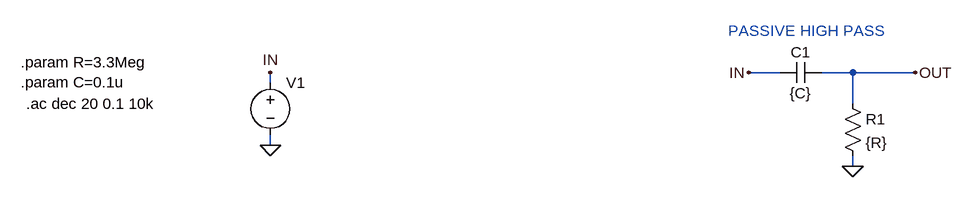
[diagram p0: schematic highpass-passive.asc]
highpass-passive.asc, the LTspice schematic file:
Version 4
SHEET 1 996 680
WIRE 720 160 672 160
WIRE 832 160 784 160
WIRE 928 160 832 160
WIRE -64 176 -64 160
WIRE 832 208 832 160
WIRE -64 272 -64 256
WIRE 832 304 832 288
FLAG 832 304 0
FLAG 928 160 OUT
FLAG 672 160 IN
FLAG -64 160 IN
FLAG -64 272 0
SYMBOL cap 784 144 R90
WINDOW 0 0 32 VBottom 2
WINDOW 3 32 32 VTop 2
SYMATTR InstName C1
SYMATTR Value {C}
SYMBOL res 816 192 R0
SYMATTR InstName R1
SYMATTR Value {R}
SYMBOL voltage -64 160 R0
WINDOW 39 0 0 Left 0
SYMATTR InstName V1
SYMATTR Value ""
SYMATTR Value2 AC 1
TEXT -448 144 Left 2 !.param R=3.3Meg\n.param C=0.1u
TEXT -440 208 Left 2 !.ac dec 20 0.1 10k
TEXT 640 96 Left 2 ;PASSIVE HIGH PASS

The netlist it stands for:
* highpass-passive.asc
C1 OUT IN {C}
R1 OUT 0 {R}
V1 IN 0 AC 1
.param R=3.3Meg
.param C=0.1u
.ac dec 20 0.1 10k
* PASSIVE HIGH PASS
.backanno
.end